# EAGLE schematic IM-EG-1 (EAGLE 7.5.0)
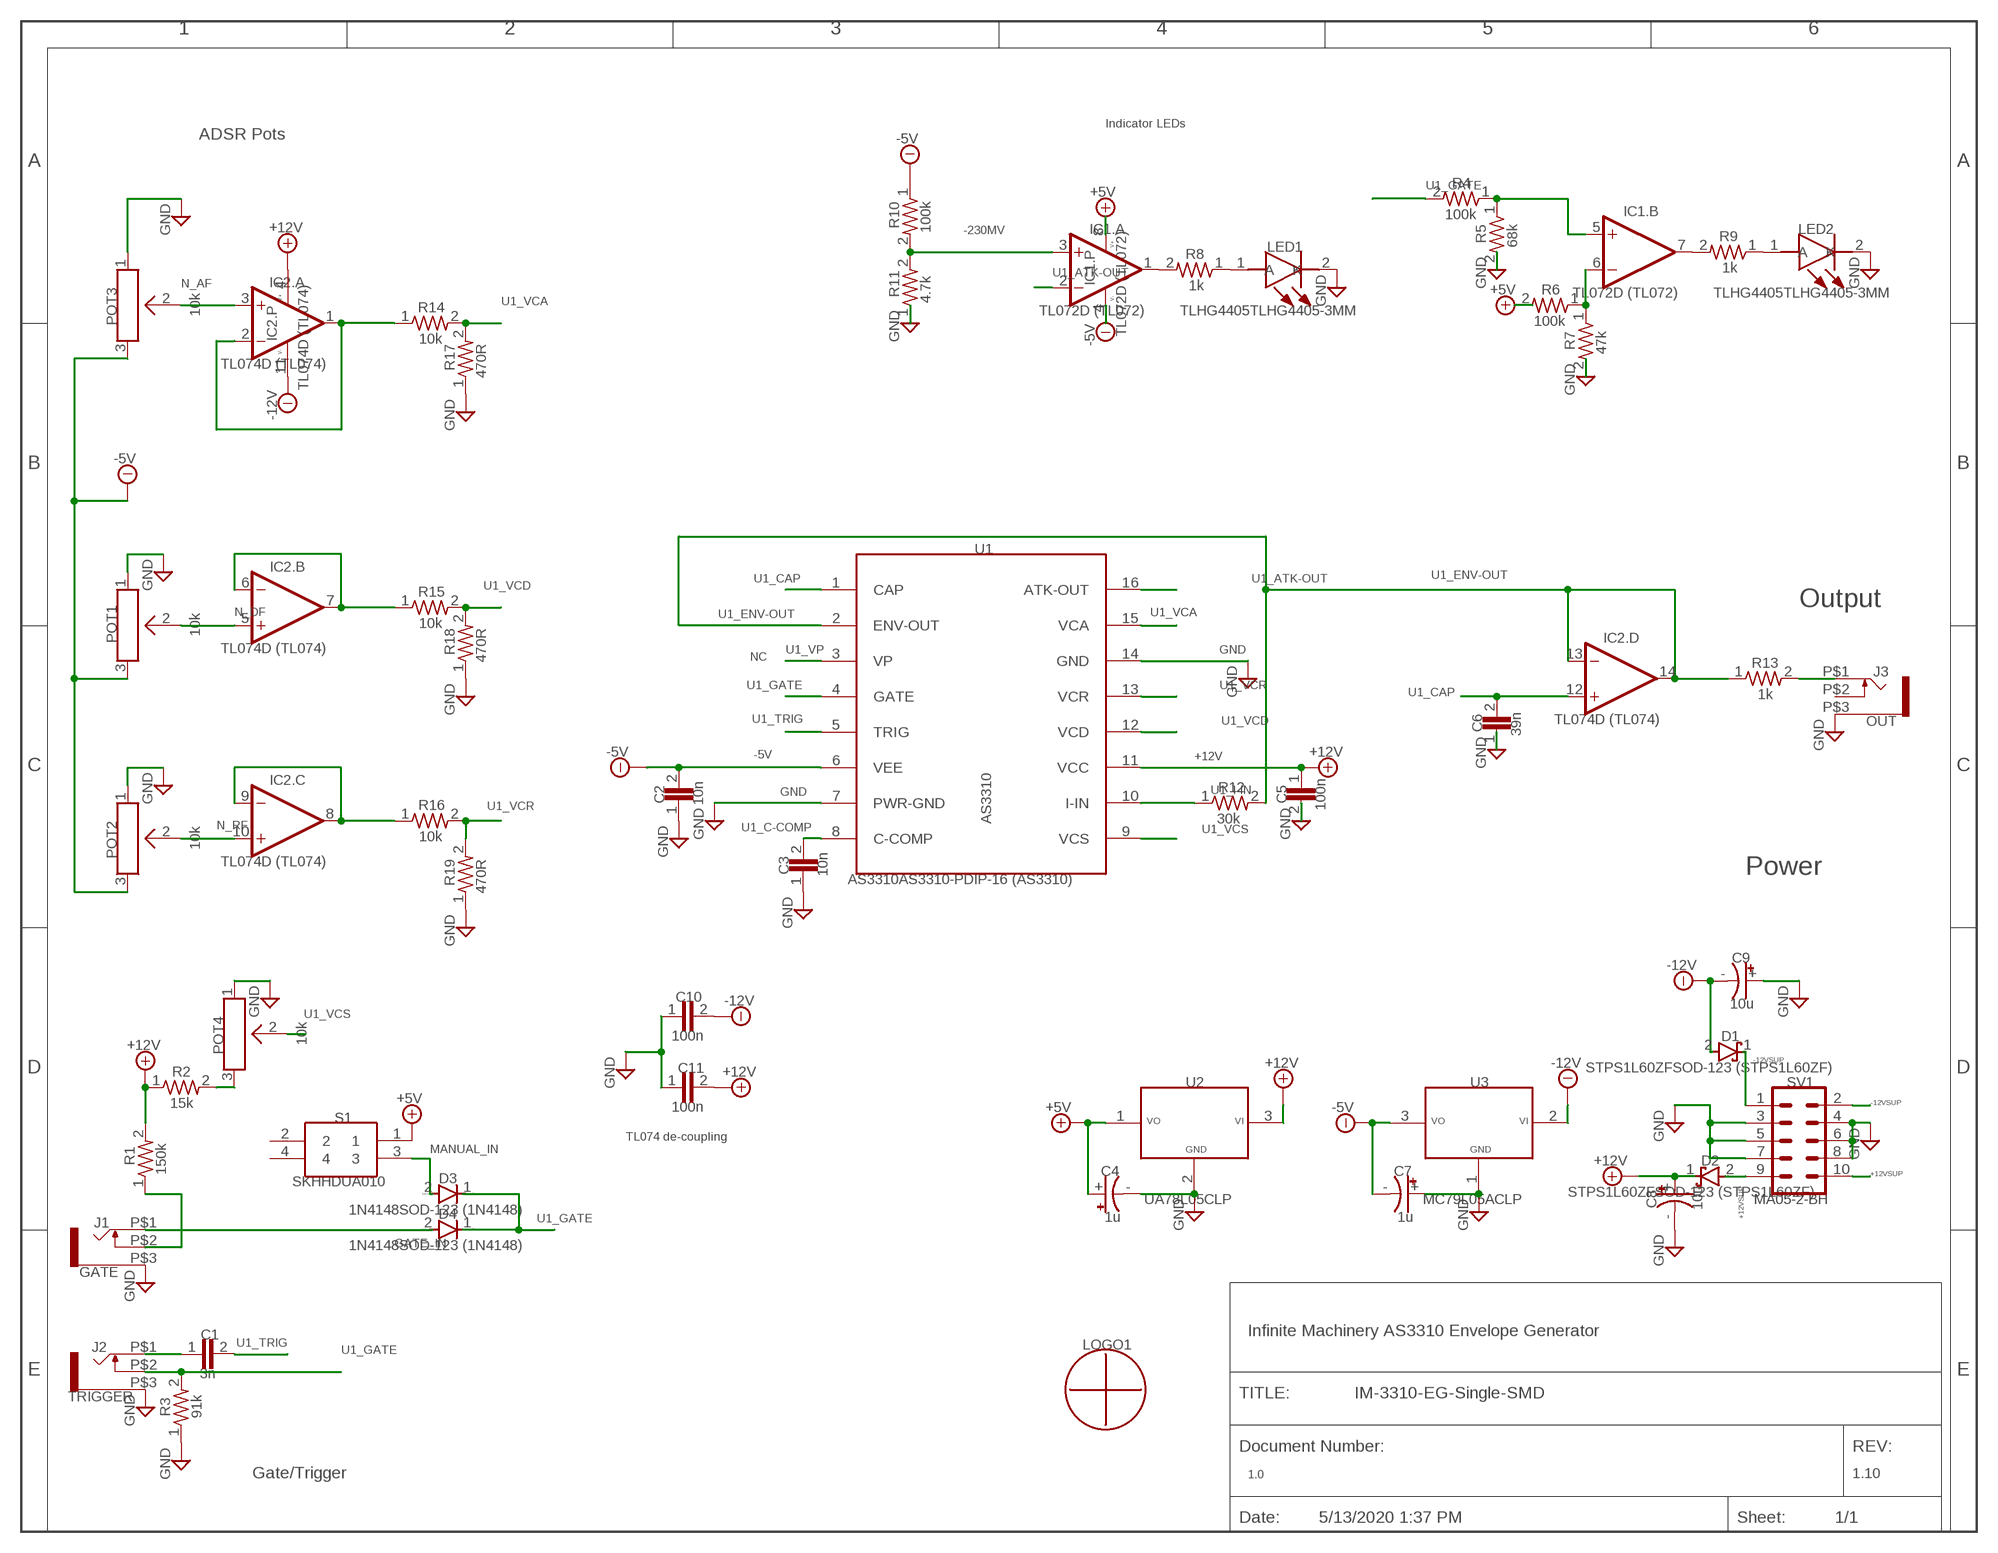
[diagram p0: schematic, sheet 1]

## Parts
C1  3n  C-EUC0805_(C-EU)  [C0805]
C2  10n  C-EUC0805_(C-EU)  [C0805]
C3  10n  C-EUC0805_(C-EU)  [C0805]
C4  1u  CPOL-USE2-5_(CPOL-US)  [E2-5]
C5  100n  C-EUC0805_(C-EU)  [C0805]
C6  39n  C-EUC0805_(C-EU)  [C0805]
C7  1u  CPOL-USE2-5_(CPOL-US)  [E2-5]
C8  10u  CPOL-USE2-5_(CPOL-US)  [E2-5]
C9  10u  CPOL-USE2-5_(CPOL-US)  [E2-5]
C10  100n  C-EUC0805_(C-EU)  [C0805]
C11  100n  C-EUC0805_(C-EU)  [C0805]
D1  STPS1L60ZFSOD-123_(STPS1L60ZF)  [SOD3516X98N]
D2  STPS1L60ZFSOD-123_(STPS1L60ZF)  [SOD3516X98N]
D3  1N4148SOD-123_(1N4148)  [SOD3715X135]
D4  1N4148SOD-123_(1N4148)  [SOD3715X135]
IC1  TL072D_(TL072)  [SO08]
IC2  TL074D_(TL074)  [SO14]
J1  GATE  WQP-PJ301M-12_JACK  [WQP-PJ301M-12_JACK]
J2  TRIGGER  WQP-PJ301M-12_JACK  [WQP-PJ301M-12_JACK]
J3  OUT  WQP-PJ301M-12_JACK_5  [WQP-PJ301M-12_JACK]
LED1  TLHG4405TLHG4405-3MM  TLHG4405TLHG4405-3MM_(TLHG4405)  [LEDRD254W60D320H440B]
LED2  TLHG4405TLHG4405-3MM  TLHG4405TLHG4405-3MM_(TLHG4405)  [LEDRD254W60D320H440B]
LOGO1  IM-LOGO-3MM-1M  [IM-LOGO-3MM-1M]
POT1  10k  ALPHA-RD901F-40-15R  [RD901F4015R1B100K00DL1]
POT2  10k  ALPHA-RD901F-40-15R  [RD901F4015R1B100K00DL1]
POT3  10k  ALPHA-RD901F-40-15R  [RD901F4015R1B100K00DL1]
POT4  10k  ALPHA-RD901F-40-15R  [RD901F4015R1B100K00DL1]
R1  150k  R-US_R0805_(R-US_)  [R0805]
R2  15k  R-US_R0805_(R-US_)  [R0805]
R3  91k  R-US_R0805_(R-US_)  [R0805]
R4  100k  R-US_R0805_(R-US_)  [R0805]
R5  68k  R-US_R0805_(R-US_)  [R0805]
R6  100k  R-US_R0805_(R-US_)  [R0805]
R7  47k  R-US_R0805_(R-US_)  [R0805]
R8  1k  R-US_R0805_(R-US_)  [R0805]
R9  1k  R-US_R0805_(R-US_)  [R0805]
R10  100k  R-US_R0805_(R-US_)  [R0805]
R11  4.7k  R-US_R0805_(R-US_)  [R0805]
R12  30k  R-US_R0805_(R-US_)  [R0805]
R13  1k  R-US_R0805_(R-US_)  [R0805]
R14  10k  R-US_R0805_(R-US_)  [R0805]
R15  10k  R-US_R0805_(R-US_)  [R0805]
R16  10k  R-US_R0805_(R-US_)  [R0805]
R17  470R  R-US_R0805_(R-US_)  [R0805]
R18  470R  R-US_R0805_(R-US_)  [R0805]
R19  470R  R-US_R0805_(R-US_)  [R0805]
S1  SKHHDUA010  [SKHHDHA010]
SV1  MA05-2-BH  [MA05-2-BH]
U1  AS3310AS3310-PDIP-16_(AS3310)  [AS3310-PDIP-16]
U2  UA78L05CLP  [TO-92]
U3  MC79L05ACLP  [TO-92]

## Nets
+5V: C4.+ IC1.8(PART_P:V+) R6.2 S1.1 U2.1(VO) ; supply symbol labelled +5V_7
+12V: C5.1 C8.+ C11.2 D2.1(C) IC2.4(PART_P:V+) R1.2 R2.1 U1.11(VCC) U2.3(VI) ; supply symbol labelled +12V_11
+12VSUP: D2.2(A) SV1.9 SV1.10
-5V: C2.2 C7.- IC1.4(PART_P:V-) POT1.3 POT2.3 POT3.3 R10.1 U1.6(VEE) U3.3(VO) ; supply symbol labelled -5V_16
-12V: C9.- C10.2 D1.2(A) IC2.11(PART_P:V-) U3.2(VI) ; supply symbol labelled -12V_19
-12VSUP: D1.1(C) SV1.1 SV1.2
-230MV: IC1.3(PART_A:+IN) R10.2 R11.2
ENV_OUT: J3.P$1 R13.2
GATE_IN: D4.2(A) J1.P$1
GND: C2.1 C3.1 C4.- C5.2 C6.1 C7.+ C8.- C9.+ C10.1 C11.1 J1.P$3 J2.P$3 J3.P$3 LED1.2(K) LED2.2(K) POT1.1 POT2.1 POT3.1 POT4.1 R3.1 R5.2 R7.2 R11.1 R17.1 R18.1 R19.1 SV1.3 SV1.4 SV1.5 SV1.6 SV1.7 SV1.8 U1.7(PWR-GND) U1.14(GND) U2.2(GND) U3.1(GND)
IC1_1: IC2.1(PART_A:OUT) IC2.2(PART_A:-IN) R14.1
IC1_7: IC2.6(PART_B:-IN) IC2.7(PART_B:OUT) R15.1
IC1_8: IC2.8(PART_C:OUT) IC2.9(PART_C:-IN) R16.1
MANUAL_IN: D3.2(A) S1.3
N$2: POT4.3 R2.2
N$5: IC1.1(PART_A:OUT) R8.2
N$6: LED1.1(A) R8.1
N$7: IC1.7(PART_B:OUT) R9.2
N$8: LED2.1(A) R9.1
N$9: IC1.6(PART_B:-IN) R6.1 R7.1
N$10: IC1.5(PART_B:+IN) R4.1 R5.1
N$11: C1.1 J2.P$1
N$13: J1.P$2 R1.1
N_AF: IC2.3(PART_A:+IN) POT3.2
N_DF: IC2.5(PART_B:+IN) POT1.2
N_RF: IC2.10(PART_C:+IN) POT2.2
U1_ATK-OUT: IC1.2(PART_A:-IN) U1.16(ATK-OUT)
U1_C-COMP: C3.2 U1.8(C-COMP)
U1_CAP: C6.2 IC2.12(PART_D:+IN) U1.1(CAP)
U1_ENV-OUT: IC2.13(PART_D:-IN) IC2.14(PART_D:OUT) R12.2 R13.1 U1.2(ENV-OUT)
U1_GATE: D3.1(C) D4.1(C) J2.P$2 R3.2 R4.2 U1.4(GATE)
U1_I-IN: R12.1 U1.10(I-IN)
U1_TRIG: C1.2 U1.5(TRIG)
U1_VCA: R14.2 R17.2 U1.15(VCA)
U1_VCD: R15.2 R18.2 U1.12(VCD)
U1_VCR: R16.2 R19.2 U1.13(VCR)
U1_VCS: POT4.2 U1.9(VCS)
U1_VP: U1.3(VP)
Unconnected: J3.P$2 S1.2 S1.4

## Notes on the sheet
- 1 | 2 | 3 | 4 | 5 | 6
- ADSR Pots | Indicator LEDs
- -5V
- A | A
- U1_GATE
- R4
- +5V
- 100k
- IC1.B
- R10
- GND | +12V | 100k | -230MV | IC1.A | LED2
- R5 | R9
- V+ | 68k
- LED1
- R8 | 1k
- U1_ATK-OUT
- 1k
- N_AF | IC2.A | IC1.P | GND | TL072D (TL072) | TLHG4405TLHG4405-3MM | GND
- R11 | +5V | R6
- V+ | V-
- U1_VCA | 4.7k | TL072D (TL072) | TLHG4405TLHG4405-3MM | GND
- 10k | R14 | 100k
- POT3
- 10k | TL072D (TL072)
- IC2.P | GND
- -5V | R7
- V- | 47k
- TL074D (TL074)
- R17
- 470R
- TL074D (TL074)
- GND
- -12V
- GND
- B | B
- -5V
- U1
- IC2.B
- U1_ENV-OUT
- U1_CAP | U1_ATK-OUT
- GND | U1_VCD
- R15
- N_DF | Output
- 10k | U1_ENV-OUT | U1_VCA
- 10k
- POT1 | TL074D (TL074) | IC2.D
- R18 | U1_VP | GND
- 470R | NC
- R13
- J3
- U1_GATE | U1_VCR | 1k
- GND | U1_CAP
- GND | TL074D (TL074) | OUT
- U1_TRIG | U1_VCD
- C6
- 39n
- GND
- C | -5V | -5V | +12V | +12V | C
- GND
- IC2.C
- GND | U1_I-IN | R12
- GND | C2 | 10n | C5
- R16 | U1_VCR | 30k | 100n
- N_RF | AS3310
- 10k | U1_C-COMP | U1_VCS
- GND | GND
- 10k
- POT2 | TL074D (TL074) | GND | Power
- C3 | 10n | AS3310AS3310-PDIP-16 (AS3310)
- R19
- 470R
- GND
- GND
- C9
- -12V
- C10 | 10u
- -12V
- GND | U1_VCS | GND
- 100n
- 10k | D1
- +12V | POT4
- D | STPS1L60ZFSOD-123 (STPS1L60ZF) | D
- -12VSUP
- +12V | -12V
- R2 | C11 | +12V
- GND | U2 | U3 | SV1
- 15k | 100n
- +5V | -12VSUP
- +5V | -5V
- VO | VI | VO | VI
- S1
- TL074 de-coupling | GND
- GND | GND
- MANUAL_IN
- GND
- R1 | +12V | D2
- 150k | SKHHDUA010 | C4 | C7 | +12VSUP
- D3 | STPS1L60ZFSOD-123 (STPS1L60ZF)
- SpiceOrder 1 | SpiceOrder 2 | UA78L05CLP | MC79L05ACLP | MA05-2-BH
- 1N4148SOD-123 (1N4148) | C8
- 1u | 1u | 10u
- D4 | +12VSUP
- U1_GATE
- J1
- SpiceOrder 1 | SpiceOrder 2
- GND | GND
- 1N4148SOD-123 (1N4148)
- GATE_IN
- GATE | GND
- GND
- C1 | Infinite Machinery AS3310 Envelope Generator
- U1_TRIG | LOGO1
- J2 | U1_GATE
- E | E
- 3n
- TRIGGER
- TITLE: | IM-3310-EG-Single-SMD
- R3 | 91k
- GND
- Document Number: | REV:
- GND | Gate/Trigger | 1.0 | 1.10
- Date: | 5/13/2020 1:37 PM | Sheet: | 1/1

## Library data of the parts
C1 = common:C-EUC0805_(C-EU); SPICEPREFIX: C
C2 C3 C5 C6 C10 C11 = common:C-EUC0805_(C-EU); SPICEPREFIX: C; VALUE: 3n
C4 C7 = common:CPOL-USE2-5_(CPOL-US); SPICEPREFIX: C; VALUE: 10u
C8 C9 = common:CPOL-USE2-5_(CPOL-US); SPICEPREFIX: C
D1 D2 = common:STPS1L60ZFSOD-123_(STPS1L60ZF)
D3 D4 = common:1N4148SOD-123_(1N4148)
IC1 = common:TL072D_(TL072)
IC2 = common:TL074D_(TL074)
J1 = common:WQP-PJ301M-12_JACK; VALUE: TRIGGER
J2 = common:WQP-PJ301M-12_JACK
J3 = common:WQP-PJ301M-12_JACK_5
LED1 LED2 = common:TLHG4405TLHG4405-3MM_(TLHG4405)
LOGO1 = common:IM-LOGO-3MM-1M
POT1-POT4 = common:ALPHA-RD901F-40-15R; DESCRIPTION: Potentiometers 9mm Linear 100K Round Shaft; HEIGHT: 25mm; MANUFACTURER_NAME: Alpha (Taiwan); MANUFACTURER_PART_NUMBER: RD901F-40-15R1-B100K-00DL1; MOUSER_PART_NUMBER: 311-1940F-15R1-B100K; MOUSER_PRICE-STOCK: https://www.mouser.com/Search/Refine.aspx?Keyword=311-1940F-15R1-B100K
R1 R2 R4-R19 = common:R-US_R0805_(R-US_); SPICEPREFIX: R; VALUE: 91k
R3 = common:R-US_R0805_(R-US_); SPICEPREFIX: R
S1 = common:SKHHDUA010; DESCRIPTION: Grey Stem Tactile Switch, SPST-NO 50 mA 13mm; HEIGHT: 17.2mm; MANUFACTURER_NAME: ALPS; MANUFACTURER_PART_NUMBER: SKHHDUA010; MOUSER_PART_NUMBER: 688-SKHHDU; MOUSER_PRICE-STOCK: https://www.mouser.com/Search/Refine.aspx?Keyword=688-SKHHDU
SV1 = common:MA05-2-BH; OC_FARNELL: unknown; OC_NEWARK: unknown
U1 = common:AS3310AS3310-PDIP-16_(AS3310)
U2 = common:UA78L05CLP
U3 = common:MC79L05ACLP